# Altium schematic sheet 2_usb_debug.SchDoc: FTDI FT4232 UART Debug Circuit
size A3; Organization: Altium Limited; Address1: L3, 12a Rodborough Rd; Address2: Frenchs Forest; Address3: NSW; Address4: Australia 2086; DocumentNumber: 3; SheetNumber: 3; SheetTotal: 3
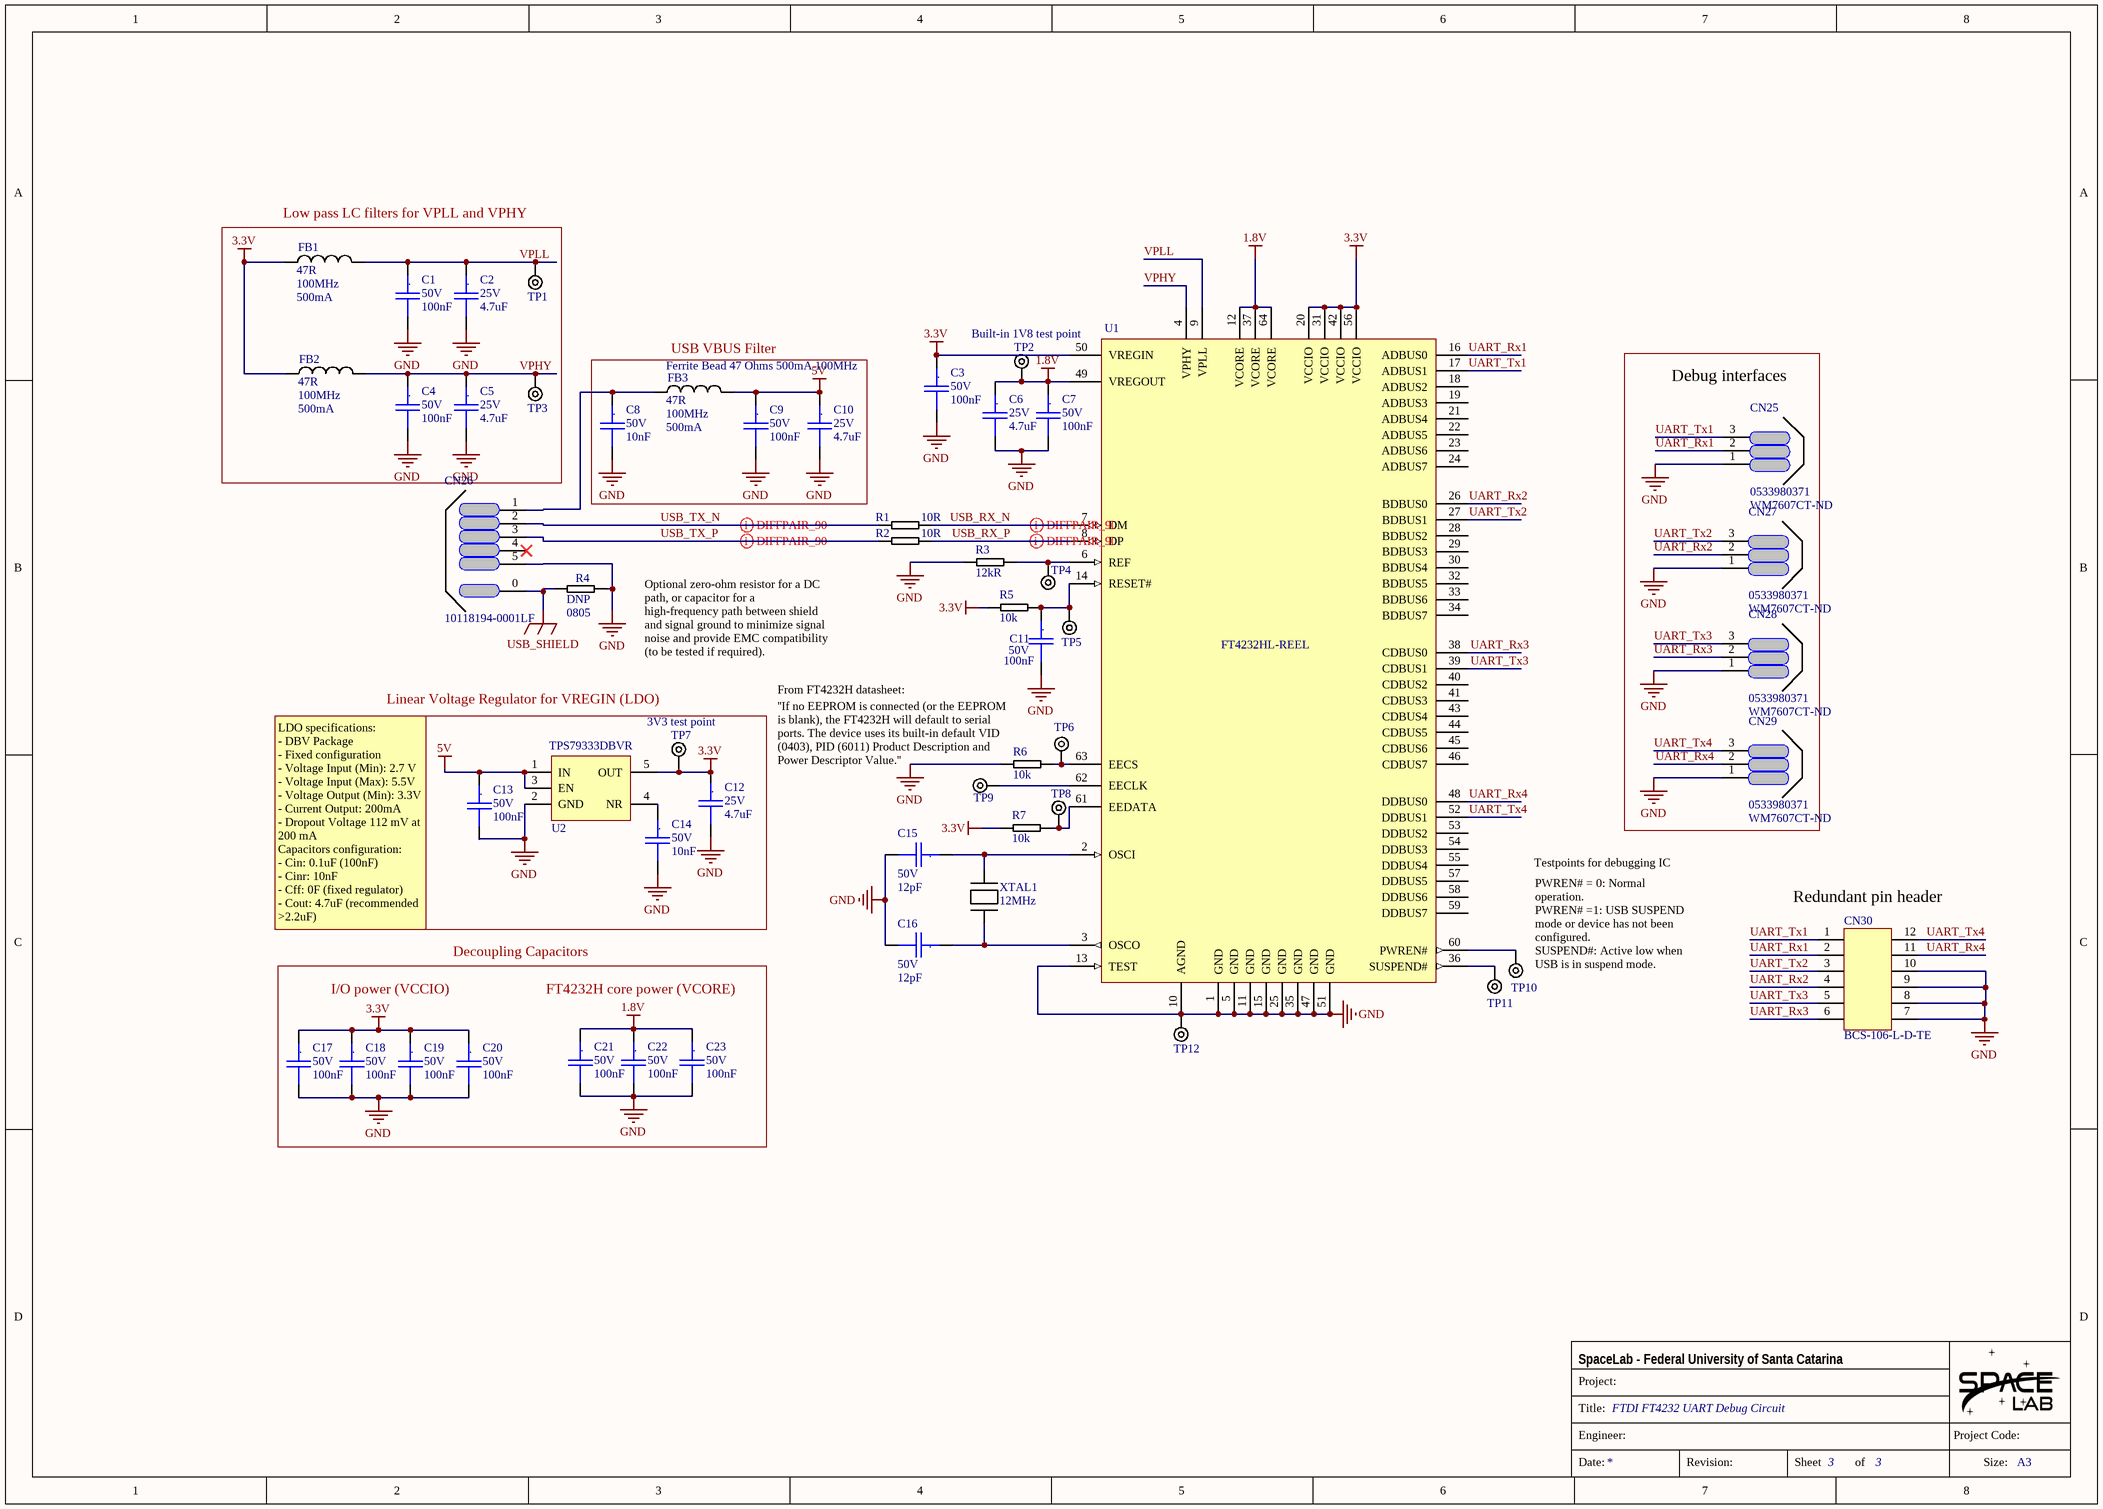
[diagram p0: 2_usb_debug.SchDoc]

## Parts
C1  Voltage Rating: 50V  Capacitance: 100nF  [C0603_MD]  (hidden comment: 0.1 uF, 0603 (1608 metric))
C2  Voltage Rating: 25V  Capacitance: 4.7uF  [C0805_MD]  (hidden comment: 4.7 uF, 0802 (2012 metric))
C3  Voltage Rating: 50V  Capacitance: 100nF  [C0603_MD]  (hidden comment: 0.1 uF, 0603 (1608 metric))
C4  Voltage Rating: 50V  Capacitance: 100nF  [C0603_MD]  (hidden comment: 0.1 uF, 0603 (1608 metric))
C5  Voltage Rating: 25V  Capacitance: 4.7uF  [C0805_MD]  (hidden comment: 4.7 uF, 0802 (2012 metric))
C6  Voltage Rating: 25V  Capacitance: 4.7uF  [C0805_MD]  (hidden comment: 4.7 uF, 0802 (2012 metric))
C7  Voltage Rating: 50V  Capacitance: 100nF  [C0603_MD]  (hidden comment: 0.1 uF, 0603 (1608 metric))
C8  Voltage: 50V  Capacitance: 10nF  [C0805_MD]  (hidden comment: 10000 pF, 0805 (2012 metric))
C9  Voltage Rating: 50V  Capacitance: 100nF  [C0603_MD]  (hidden comment: 0.1 uF, 0603 (1608 metric))
C10  Voltage Rating: 25V  Capacitance: 4.7uF  [C0805_MD]  (hidden comment: 4.7 uF, 0802 (2012 metric))
C11  Voltage Rating: 50V  Capacitance: 100nF  [C0603_MD]  (hidden comment: 0.1 uF, 0603 (1608 metric))
C12  Voltage Rating: 25V  Capacitance: 4.7uF  [C0805_MD]  (hidden comment: 4.7 uF, 0802 (2012 metric))
C13  Voltage Rating: 50V  Capacitance: 100nF  [C0603_MD]  (hidden comment: 0.1 uF, 0603 (1608 metric))
C14  Voltage: 50V  Capacitance: 10nF  [C0805_MD]  (hidden comment: 10000 pF, 0805 (2012 metric))
C15  Voltage: 50V  Capacitance: 12pF  [C0603_MD]  (hidden comment: 12 pF, 0603 (1608 metric))
C16  Voltage: 50V  Capacitance: 12pF  [C0603_MD]  (hidden comment: 12 pF, 0603 (1608 metric))
C17  Voltage Rating: 50V  Capacitance: 100nF  [C0603_MD]  (hidden comment: 0.1 uF, 0603 (1608 metric))
C18  Voltage Rating: 50V  Capacitance: 100nF  [C0603_MD]  (hidden comment: 0.1 uF, 0603 (1608 metric))
C19  Voltage Rating: 50V  Capacitance: 100nF  [C0603_MD]  (hidden comment: 0.1 uF, 0603 (1608 metric))
C20  Voltage Rating: 50V  Capacitance: 100nF  [C0603_MD]  (hidden comment: 0.1 uF, 0603 (1608 metric))
C21  Voltage Rating: 50V  Capacitance: 100nF  [C0603_MD]  (hidden comment: 0.1 uF, 0603 (1608 metric))
C22  Voltage Rating: 50V  Capacitance: 100nF  [C0603_MD]  (hidden comment: 0.1 uF, 0603 (1608 metric))
C23  Voltage Rating: 50V  Capacitance: 100nF  [C0603_MD]  (hidden comment: 0.1 uF, 0603 (1608 metric))
CN25  Supplier Part Number 1: WM7607CT-ND  [PICO BLADE 0533980371]  (hidden comment: 0533980371)
CN26  10118194-0001LF  [MICRO USB B 90GRAUS]
CN27  Supplier Part Number 1: WM7607CT-ND  [PICO BLADE 0533980371]  (hidden comment: 0533980371)
CN28  Supplier Part Number 1: WM7607CT-ND  [PICO BLADE 0533980371]  (hidden comment: 0533980371)
CN29  Supplier Part Number 1: WM7607CT-ND  [PICO BLADE 0533980371]  (hidden comment: 0533980371)
CN30  BCS-106-L-D-TE  [BCS-106-L-D-TE]
FB1  Impedance: 47R  Test Frequency: 100MHz  Current Rating: 500mA  [L0603]  (hidden comment: Ferrite Bead 47 Ohms 500mA 100MHz)
FB2  Impedance: 47R  Test Frequency: 100MHz  Current Rating: 500mA  [L0603]  (hidden comment: Ferrite Bead 47 Ohms 500mA 100MHz)
FB3  Ferrite Bead 47 Ohms 500mA 100MHz  Impedance: 47R  Test Frequency: 100MHz  Current Rating: 500mA  [L0603]
R1  Resistance: 10R  [R0603_MD]  (hidden comment: RES 10 ohms (0603))
R2  Resistance: 10R  [R0603_MD]  (hidden comment: RES 10 ohms (0603))
R3  Resistance: 12kR  [R0805_MD]  (hidden comment: RES 12K ohms (0805))
R4  DNP  Case/Package: 0805  [R0805_MD]
R5  value 10k  [R0805_MD]  (hidden comment: 10k ohms, 0805 (2012 metric))
R6  value 10k  [R0805_MD]  (hidden comment: 10k ohms, 0805 (2012 metric))
R7  value 10k  [R0805_MD]  (hidden comment: 10k ohms, 0805 (2012 metric))
TP1  DNP  [TEST POINT PTH]  (value not drawn)  (no BOM)
TP2  DNP  [TEST POINT PTH]  (value not drawn)  (no BOM)
TP3  DNP  [TEST POINT PTH]  (value not drawn)  (no BOM)
TP4  DNP  [TEST POINT PTH]  (value not drawn)  (no BOM)
TP5  DNP  [TEST POINT PTH]  (value not drawn)  (no BOM)
TP6  DNP  [TEST POINT PTH]  (value not drawn)  (no BOM)
TP7  DNP  [TEST POINT PTH]  (value not drawn)  (no BOM)
TP8  DNP  [TEST POINT PTH]  (value not drawn)  (no BOM)
TP9  DNP  [TEST POINT PTH]  (value not drawn)  (no BOM)
TP10  DNP  [TEST POINT PTH]  (value not drawn)  (no BOM)
TP11  DNP  [TEST POINT PTH]  (value not drawn)  (no BOM)
TP12  DNP  [TEST POINT PTH]  (value not drawn)  (no BOM)
U1  FT4232HL-REEL  [LQFP-64]
U2  TPS79333DBVR  [SOT23-5]
XTAL1  Frequency: 12MHz  [TXC 7A Series]  (hidden comment: 12.000MHz 12pF)

## Blocks framed on the sheet
Low pass LC filters for VPLL and VPHY: C1 C2 C4 C5 FB1 FB2 TP1 TP3
USB VBUS Filter: C8-C10 FB3
Debug interfaces: CN25 CN27-CN29
Linear Voltage Regulator for VREGIN (LDO): C12-C14 TP7 U2

## Nets
1.8V: C6.1 C7.1 C21.1 C22.1 C23.1 TP2.1 U1.12(VCORE) U1.37(VCORE) U1.49(VREGOUT) U1.64(VCORE)
3.3V: C3.1 C12.1 C17.1 C18.1 C19.1 C20.1 FB1.1 FB2.1 R5.1 R7.1 TP7.1 U1.20(VCCIO) U1.31(VCCIO) U1.42(VCCIO) U1.50(VREGIN) U1.56(VCCIO) U2.5(OUT)
5V: C9.1 C10.1 C13.1 FB3.2 U2.1(IN) U2.3(EN)
GND: C1.2 C2.2 C3.2 C4.2 C5.2 C6.2 C7.2 C8.2 C9.2 C10.2 C11.2 C12.2 C13.2 C14.2 C15.2 C16.2 C17.2 C18.2 C19.2 C20.2 C21.2 C22.2 C23.2 CN25.1 CN26.5 CN27.1 CN28.1 CN29.1 CN30.7 CN30.8 CN30.9 CN30.10 R3.1 R4.2 R6.1 TP12.1 U1.1(GND) U1.5(GND) U1.10(AGND) U1.11(GND) U1.13(TEST) U1.15(GND) U1.25(GND) U1.35(GND) U1.47(GND) U1.51(GND) U2.2(GND)
USB_SHIELD: CN26.0 R4.1
UART_Rx1: CN25.2 CN30.2 U1.16(ADBUS0)
UART_Rx2: CN27.2 CN30.4 U1.26(BDBUS0)
UART_Rx3: CN28.2 CN30.6 U1.38(CDBUS0)
UART_Rx4: CN29.2 CN30.11 U1.48(DDBUS0)
UART_Tx1: CN25.3 CN30.1 U1.17(ADBUS1)
UART_Tx2: CN27.3 CN30.3 U1.27(BDBUS1)
UART_Tx3: CN28.3 CN30.5 U1.39(CDBUS1)
UART_Tx4: CN29.3 CN30.12 U1.52(DDBUS1)
USB_RX_N: R1.2 U1.7(DM)
USB_RX_P: R2.2 U1.8(DP)
USB_TX_N: CN26.2 R1.1
USB_TX_P: CN26.3 R2.1
VPHY: C4.1 C5.1 FB2.2 TP3.1 U1.4(VPHY)
VPLL: C1.1 C2.1 FB1.2 TP1.1 U1.9(VPLL)
NetC8_1: C8.1 CN26.1 FB3.1
NetC11_1: C11.1 R5.2 TP5.1 U1.14(RESET#)
NetC14_1: C14.1 U2.4(NR)
NetC15_1: C15.1 U1.2(OSCI) XTAL1.1
NetC16_1: C16.1 U1.3(OSCO) XTAL1.2
NetR3_2: R3.2 TP4.1 U1.6(REF)
NetR6_2: R6.2 TP6.1 U1.63(EECS)
NetR7_2: R7.2 TP8.1 U1.61(EEDATA)
NetTP9_1: TP9.1 U1.62(EECLK)
NetTP10_1: TP10.1 U1.60(PWREN#)
NetTP11_1: TP11.1 U1.36(SUSPEND#)

Not connected (* = marked no-connect by the designer): CN26 4*; U1 18(ADBUS2) 19(ADBUS3) 21(ADBUS4) 22(ADBUS5) 23(ADBUS6) 24(ADBUS7) 28(BDBUS2) 29(BDBUS3) 30(BDBUS4) 32(BDBUS5) 33(BDBUS6) 34(BDBUS7) 40(CDBUS2) 41(CDBUS3) 43(CDBUS4) 44(CDBUS5) 45(CDBUS6) 46(CDBUS7) 53(DDBUS2) 54(DDBUS3) 55(DDBUS4) 57(DDBUS5) 58(DDBUS6) 59(DDBUS7)

## Layout directives
differential pair: USB_RX_N, USB_RX_P, USB_TX_N, USB_TX_P

## Notes on the sheet
- (near U1) Built-in 1V8 test point
- Optional zero-ohm resistor for a DC path, or capacitor for a high-frequency path between shield and signal ground to minimize signal noise and provide EMC compatibility (to be tested if required).
- From FT4232H datasheet:
- (near TP7) 3V3 test point
- (near R6) ''If no EEPROM is connected (or the EEPROM is blank), the FT4232H will default to serial ports. The device uses its built-in default VID (0403), PID (6011) Product Description and Power Descriptor Value.''
- (near C13) LDO specifications:
  - DBV Package
  - Fixed configuration
  - Voltage Input (Min): 2.7 V
  - Voltage Input (Max): 5.5V
  - Voltage Output (Min): 3.3V
  - Current Output: 200mA
  - Dropout Voltage 112 mV at 200 mA
  Capacitors configuration:
  - Cin: 0.1uF (100nF)
  - Cinr: 10nF
  - Cff: 0F (fixed regulator)
  - Cout: 4.7uF (recommended >2.2uF)
- Testpoints for debugging IC
- (near CN30) Redundant pin header
- Decoupling Capacitors
- (near TP10) PWREN# = 0: Normal operation.
  PWREN# =1: USB SUSPEND mode or device has not been configured.
  SUSPEND#: Active low when USB is in suspend mode.
- I/O power (VCCIO)
- FT4232H core power (VCORE)
- Project:
- SpaceLab - Federal University of Santa Catarina
- Title:
- Engineer:
- Project Code:
- Date:
- Revision:
- Sheet
- of
- Size:
- A3
- (in symbol 08055C103KAT4A) .
- (in symbol C1608X7R1H104K080AA) .
- (in symbol C2012X7R1E475K125AB) .
- (in symbol CL10C120JB8NNNC) .

## Library data of the parts
C1 C3 C4 C7 C9 C11 C13 C17-C23 = C1608X7R1H104K080AA: TDK - C1608X7R1H104K080AA - SMD Multilayer Ceramic Capacitor, 0.1 µF, 50 V, 0603 [1608 Metric], ± 10%, X7R, C Series; Supplier 1: Digi-Key; Supplier Part Number 1: 445-1314-1-ND; Manufacturer: TDK; Stock 1: 513759; Pricing 1: 1=0.12, 10=0.088, 100=0.0413, 500=0.02896, 1000=0.02397 (USD); Mount: Surface Mount; Case/Package: 0603; Number of Pins: 2; Weight: 7.1E-05oz; Case Code (Imperial): 0603; Case Code (Metric): 1608; Dielectric Material: Ceramic; Min Operating Temperature: -55°C; Max Operating Temperature: 125°C; Tolerance: 10%; Dielectric: X7R; Packaging: Tape and Reel; Package Quantity: 1; Termination: SMD/SMT; Voltage: 50V; Voltage Rating (DC): 50V; Composition: Ceramic; Length: 1.6mm; Height: 0.8mm; Depth: 0.8mm; Width: 0.8mm; Thickness: 0.037inch; Radiation Hardening: No; REACH SVHC: No SVHC; Lead Free: Lead Free; ComponentLink1URL: https://product.tdk.com/info/en/catalog/spec/mlccspec_commercial_general_midvoltage_en.pdf?src-supplier=Digi-Key; ComponentLink1Description: https://product.tdk.com/info/en/catalog/spec/mlccspec_commercial_general_midvoltage_en.pdf?src-supplier=Digi-Key; ComponentLink2URL: http://uk.rs-online.com/webdocs/13d1/0900766b813d1103.pdf?src-supplier=RSComponents; ComponentLink2Description: http://uk.rs-online.com/webdocs/13d1/0900766b813d1103.pdf?src-supplier=RSComponents; ComponentLink3URL: http://www.tdk.co.jp/tefe02/e412_c.pdf?src-supplier=Avnet+Europe; ComponentLink3Description: http://www.tdk.co.jp/tefe02/e412_c.pdf?src-supplier=Avnet+Europe; ComponentLink4URL: http://www.farnell.com/datasheets/2792994.pdf?src-supplier=Farnell; ComponentLink4Description: http://www.farnell.com/datasheets/2792994.pdf?src-supplier=Farnell; ComponentLink5URL: http://www.farnell.com/datasheets/1744655.pdf?src-supplier=Element14; ComponentLink5Description: http://www.farnell.com/datasheets/1744655.pdf?src-supplier=Element14; Supplier 2: Mouser; Supplier Part Number 2: 810-C1608X7R1H104K; Stock 2: 34512; Pricing 2: 1=0.12, 10=0.088, 100=0.041, 500=0.029, 1000=0.024, 4000=0.017, 8000=0.016, 24000=0.013, 48000=0.011 (USD); Manufacturer Part Number: C1608X7R1H104K080AA
C2 C5 C6 C10 C12 = C2012X7R1E475K125AB: Ceramic Capacitor SMD Multilayer, 0805 [2012 Metric], 4.7 uF, 25 V,  10%, X7R, C Series; Manufacturer: TDK; Supplier 1: Digi-Key; Supplier Part Number 1: 445-5972-1-ND; Stock 1: 196988; Pricing 1: 1=0.48, 10=0.339, 100=0.223, 500=0.16518, 1000=0.1404 (USD); Mount: Surface Mount; Case/Package: 0805; Weight: 0.000194oz; Case Code (Metric): 2012; Case Code (Imperial): 0805; Dielectric Material: Ceramic; Min Operating Temperature: -55°C; Max Operating Temperature: 125°C; Tolerance: 10%; Dielectric: X7R; Packaging: Tape and Reel; Voltage Rating (DC): 25V; Termination: SMD/SMT; Package Quantity: 2000; Composition: Ceramic; Voltage: 25V; Length: 2mm; Height: 1.25mm; Width: 0.049inch; Depth: 1.25mm; Thickness: 0.057inch; Radiation Hardening: No; Lead Free: Lead Free; REACH SVHC: No SVHC; ComponentLink1URL: http://www.mouser.com/ds/2/400/lcc_commercial_general_en-837201.pdf?src-supplier=Mouser; ComponentLink1Description: http://www.mouser.com/ds/2/400/lcc_commercial_general_en-837201.pdf?src-supplier=Mouser; ComponentLink2URL: https://product.tdk.com/info/en/catalog/spec/mlccspec_commercial_general_midvoltage_en.pdf?src-supplier=Digi-Key; ComponentLink2Description: https://product.tdk.com/info/en/catalog/spec/mlccspec_commercial_general_midvoltage_en.pdf?src-supplier=Digi-Key; ComponentLink3URL: http://www.farnell.com/datasheets/1796654.pdf?src-supplier=Newark; ComponentLink3Description: http://www.farnell.com/datasheets/1796654.pdf?src-supplier=Newark; ComponentLink4URL: http://www.tdk.co.jp/tefe02/e412_c.pdf?src-supplier=Avnet+Europe; ComponentLink4Description: http://www.tdk.co.jp/tefe02/e412_c.pdf?src-supplier=Avnet+Europe; Supplier 2: Mouser; Supplier Part Number 2: 810-C2012X7R1E475K; Stock 2: 141636; Pricing 2: 1=0.54, 10=0.382, 100=0.251, 500=0.186, 1000=0.158, 2000=0.121 (USD); Manufacturer Part Number: C2012X7R1E475K125AB
C8 C14 = 08055C103KAT4A: AVX - 08055C103KAT4A - SMD Multilayer Ceramic Capacitor, 10000 pF, 50 V, 0805 [2012 Metric], &#177; 10%, X7R; Manufacturer: Kyocera AVX; Supplier 1: Digi-Key; Supplier Part Number 1: 478-10687-1-ND; Stock 1: 515489; Pricing 1: 1=0.13, 10=0.094, 100=0.044, 500=0.03086, 1000=0.02555, 2500=0.02378, 5000=0.02176 (USD); Mount: Surface Mount; Case/Package: 0805; Number of Pins: 2; Weight: 0.000194oz; Case Code (Imperial): 0805; Case Code (Metric): 2012; Min Operating Temperature: -55°C; Max Operating Temperature: 125°C; Tolerance: 10%; Dielectric: X7R; Packaging: Tape and Reel; Voltage Rating: 50V; Voltage Rating (DC): 50V; Termination: SMD/SMT; Length: 2.01mm; Height: 0.94mm; Depth: 1.25mm; Width: 1.25mm; Radiation Hardening: No; Lead Free: Lead Free; ComponentLink1URL: http://www.mouser.com/ds/2/40/X7RDielectric-777024.pdf?src-supplier=Mouser; ComponentLink1Description: http://www.mouser.com/ds/2/40/X7RDielectric-777024.pdf?src-supplier=Mouser; ComponentLink2URL: http://www.avx.com/docs/Catalogs/cx7r.pdf?src-supplier=Future+Electronics; ComponentLink2Description: http://www.avx.com/docs/Catalogs/cx7r.pdf?src-supplier=Future+Electronics; Supplier 2: Mouser; Supplier Part Number 2: 581-08055C103KAT4A; Stock 2: 88428; Pricing 2: 1=0.12, 10=0.085, 100=0.04, 500=0.028, 1000=0.023, 2500=0.018 (USD); Manufacturer Part Number: 08055C103KAT4A
C15 C16 = CL10C120JB8NNNC: Cap Ceramic 12pF 50VDC C0G 5% SMD 0603 Paper T/R; Manufacturer: Samsung; Temperature Coefficient: 300ppm/°C; Supplier 1: Digi-Key; Supplier Part Number 1: 1276-1254-1-ND; Stock 1: 64675; Pricing 1: 1=0.1, 10=0.045, 100=0.0201, 500=0.01436, 1000=0.01128 (USD); Mount: Surface Mount; Case/Package: 0603; Case Code (Metric): 1608; Case Code (Imperial): 0603; Material: Ceramic; Contact Plating: Tin; Min Operating Temperature: -55°C; Max Operating Temperature: 125°C; Dielectric: C0G; Voltage Rating (DC): 50V; Voltage Rating: 50V; Package Quantity: 1; Packaging: Tape and Reel; Length: 1.6mm; Height: 0.8mm; Depth: 0.8mm; Width: 0.031inch; Thickness: 0.035inch; Radiation Hardening: No; Lead Free: Lead Free; ComponentLink1URL: https://media.digikey.com/pdf/Data%20Sheets/Samsung%20PDFs/CL_Series_MLCC_ds.pdf?src-supplier=Digi-Key; ComponentLink1Description: https://media.digikey.com/pdf/Data%20Sheets/Samsung%20PDFs/CL_Series_MLCC_ds.pdf?src-supplier=Digi-Key; ComponentLink2URL: https://www.verical.com/server-webapp/html/getDatasheet?partID=640658&src-supplier=Verical; ComponentLink2Description: https://www.verical.com/server-webapp/html/getDatasheet?partID=640658&src-supplier=Verical; ComponentLink3URL: https://produktinfo.conrad.com/datenblaetter/450000-474999/457317-da-01-en-VS_KONDENSATOR_0603.pdf?src-supplier=Conrad; ComponentLink3Description: https://produktinfo.conrad.com/datenblaetter/450000-474999/457317-da-01-en-VS_KONDENSATOR_0603.pdf?src-supplier=Conrad; Manufacturer Part Number: CL10C120JB8NNNC; Tolerance: 5%
CN25 CN27-CN29 = 0533980371: Conn Wire to Board HDR 3 POS 1.25mm Solder ST SMD Embossed T/R; Manufacturer: Molex; Manufacturer Part Number: 53398-0371; N of Positions: 3; Body Plating: Tin; Current Rating: 1A; Voltage Rating: 125V; Contact Resistance: 20mR; Insulation Resistance: 100MR; Gender: Male; Glow Wire Compliant: Non-compliant; Pitch: 1.25mm; Mount Type: SMD; Value: 0533980371; Supplier 1: Digi-Key; RoHS: Yes; Category: Headers and Wire Housings; Stock 1: 192; Pricing 1: 1=0.64000, 10=0.54400, 100=0.42320 (USD); Mount: Surface Mount; Contact Plating: Tin; Color: Natural; Contact Material: Bronze,Tin; Housing Color: Natural; Housing Material: Nylon; Min Operating Temperature: -40°C; Max Operating Temperature: 85°C; Packaging: Tape and Reel; Orientation: Vertical; Number of Rows: 1; Voltage Rating (AC): 125V; Contact Gender: Male; Package Quantity: 1000; Number of Positions: 3; Termination: SMD/SMT; Number of Contacts: 3; Working Voltage: 125V; Voltage Rating (DC): 125V; Number of Circuits: 3; Lead Pitch: 1.25mm; Radiation Hardening: No; Flammability Rating: UL94 V-0; REACH SVHC: Unknown; Lead Free: Lead Free; ComponentLink1URL: https://datasheet.ciiva.com/30064/225330533980371-pcb-headers-30064544.pdf?src-supplier=Onlinecomponents.com; ComponentLink1Description: https://datasheet.ciiva.com/30064/225330533980371-pcb-headers-30064544.pdf?src-supplier=Onlinecomponents.com; ComponentLink2URL: https://datasheet.ciiva.com/9468/0533980371-pcb-headers-9468515.pdf?src-supplier=Avnet; ComponentLink2Description: https://datasheet.ciiva.com/9468/0533980371-pcb-headers-9468515.pdf?src-supplier=Avnet; ComponentLink3URL: https://datasheet.ciiva.com/11748/0900766b8078fc93-11748675.pdf?src-supplier=RSComponents; ComponentLink3Description: https://datasheet.ciiva.com/11748/0900766b8078fc93-11748675.pdf?src-supplier=RSComponents; ComponentLink4URL: https://datasheet.ciiva.com/19465/1302182-19465258.pdf?src-supplier=Jameco; ComponentLink4Description: https://datasheet.ciiva.com/19465/1302182-19465258.pdf?src-supplier=Jameco; ComponentLink5URL: https://datasheet.ciiva.com/5147/0533980371-pcb-headers-146663-5147630.pdf?src-supplier=Mouser; ComponentLink5Description: https://datasheet.ciiva.com/5147/0533980371-pcb-headers-146663-5147630.pdf?src-supplier=Mouser; ComponentLink6URL: https://datasheet.ciiva.com/16972/70091287-16972277.pdf?src-supplier=Allied+Electronics; ComponentLink6Description: https://datasheet.ciiva.com/16972/70091287-16972277.pdf?src-supplier=Allied+Electronics; ComponentLink7URL: https://datasheet.ciiva.com/7810/1788579-7810395.pdf?src-supplier=Element14; ComponentLink7Description: https://datasheet.ciiva.com/7810/1788579-7810395.pdf?src-supplier=Element14; ComponentLink8URL: https://datasheet.ciiva.com/16496/0533980371-pcb-headers-16496972.pdf?src-supplier=Avnet+Asia; ComponentLink8Description: https://datasheet.ciiva.com/16496/0533980371-pcb-headers-16496972.pdf?src-supplier=Avnet+Asia; ComponentLink9URL: https://datasheet.ciiva.com/16658/0533980371-pcb-headers-16658430.pdf?src-supplier=Avnet+Europe; ComponentLink9Description: https://datasheet.ciiva.com/16658/0533980371-pcb-headers-16658430.pdf?src-supplier=Avnet+Europe
CN26 = 10118194-0001LF: CONN USB MICRO B RECPT SMT R/A; Manufacturer: FCI; N of Positions: 5; Pitch: 0.65mm; Gender: Receptacle; Current Rating: 1.8A; Connector Type: USB,Receptacle; Insulation Resistance: 1GR; Number of Ports: 1; Max Voltage Rating (AC): 100V; Mount Type: PTH; Supplier 1: Digi-Key; Supplier 2: Farnell; Supplier 3: Mouser; Supplier 4: Newark; Supplier Part Number 1: 609-4618-1-ND; Supplier Part Number 2: 1645325; Supplier Part Number 3: 649-10118194-0001LF; Supplier Part Number 4: 67T2260; Value: 10118194-0001LF; Manufacturer Part Number: 10118194-0001LF; RoHS: Yes; Category: USB Connectors; Stock 4: 39603; Pricing 4: 1=0.22400, 25=0.22400, 100=0.22400, 250=0.20500, 500=0.20500 (USD); Mount: Surface Mount,Horizontal; Color: Black; Contact Material: Copper Alloy; Contact Plating: Gold; Number of Terminals/Pins: 5; Housing Material: Polymer; Min Operating Temperature: -55°C; Max Operating Temperature: 85°C; Package Quantity: 9600; Packaging: Tape and Reel; Number of Contacts: 5; Termination: Solder; Orientation: Right Angle; Features: Shielded; Length: 8.05mm; Depth: 5mm; Radiation Hardening: No; Lead Free: Lead Free; Flammability Rating: UL94 V-0; ComponentLink1URL: https://datasheet.ciiva.com/4598/10118194ac-197217-4598807.pdf?src-supplier=Mouser; ComponentLink1Description: https://datasheet.ciiva.com/4598/10118194ac-197217-4598807.pdf?src-supplier=Mouser; ComponentLink2URL: https://datasheet.ciiva.com/26945/getdatasheetpartid-418619-26945695.pdf?src-supplier=Verical; ComponentLink2Description: https://datasheet.ciiva.com/26945/getdatasheetpartid-418619-26945695.pdf?src-supplier=Verical; ComponentLink3URL: https://datasheet.ciiva.com/851/10118194-851110.pdf?src-supplier=Digi-Key; ComponentLink3Description: https://datasheet.ciiva.com/851/10118194-851110.pdf?src-supplier=Digi-Key; ComponentLink4URL: https://datasheet.ciiva.com/851/10118194-851111.pdf?src-supplier=Digi-Key; ComponentLink4Description: https://datasheet.ciiva.com/851/10118194-851111.pdf?src-supplier=Digi-Key
CN30 = BCS-106-L-D-TE: CONN RCPT 12POS 0.1 GOLD PCB; Manufacturer: Samtec; Number of Contacts: 12; Gender: Receptacle; Max Current Rating: 5.9A; Contact Resistance: 10mR; Max Voltage Rating (AC): 475V; Pitch: 2.54mm; Row Spacing: 0.1inch; Supplier 1: Digi-Key; Manufacturer Part Number: BCS-106-L-D-TE; RoHS: Yes; Category: Connectors; Stock 1: 7411; Pricing 1: 1=1.77000, 10=1.60200, 25=1.50360, 50=1.43820, 100=1.37290, 250=1.24216, 500=1.14408 (USD); Mount: Through Hole; Contact Plating: Gold; Contact Material: Bronze; Color: Black; Housing Color: Black; Housing Material: Polymer; Min Operating Temperature: -55°C; Max Operating Temperature: 125°C; Number of Rows: 2; Termination: Solder; Packaging: Rail/Tube; Connector Type: Receptacle; Number of Positions: 12; Orientation: Vertical; Length: 15.24mm; Depth: 5.08mm; Width: 5.08mm; Radiation Hardening: No; REACH SVHC: No SVHC; Lead Free: Lead Free; ComponentLink1URL: https://datasheet.ciiva.com/16706/bcs-16706444.pdf?src-supplier=Avnet+Europe; ComponentLink1Description: https://datasheet.ciiva.com/16706/bcs-16706444.pdf?src-supplier=Avnet+Europe; ComponentLink2URL: https://datasheet.ciiva.com/413/bcs-1xx-xxx-x-xx-xxx-mkt-413758.pdf?src-supplier=Digi-Key; ComponentLink2Description: https://datasheet.ciiva.com/413/bcs-1xx-xxx-x-xx-xxx-mkt-413758.pdf?src-supplier=Digi-Key; Supplier Part Number 1: SAM1008-06-ND
FB1-FB3 = 742792608: WURTH ELEKTRONIK   742792608   FERRITE BEAD, 0.1 OHM, 0.5A, 0603; Manufacturer: Wurth Electronics; Resistance: 100mR; Inductance: 1H; Tolerance: 25%; Number of Lines: 1; Supplier 1: Digi-Key; Supplier Part Number 1: 732-1596-1-ND; Stock 1: 969; Pricing 1: 1=0.17, 50=0.168, 100=0.155, 500=0.148, 1000=0.141, 2000=0.134 (USD); Mount: Surface Mount; Case/Package: SMD/SMT; Weight: 0.000141oz; Core Material: Ferrite; Case Code (Metric): 1608; Case Code (Imperial): 0603; Material: Ferrite; Min Operating Temperature: -55°C; Max Operating Temperature: 125°C; Package Quantity: 1; Packaging: Tape and Reel; Max Current Rating: 500mA; DC Resistance (DCR): 100mR; Max DC Current: 500mA; Termination: SMD/SMT; Length: 1.6mm; Height: 0.8mm; Width: 0.8mm; Depth: 0.8mm; REACH SVHC: Unknown; Lead Free: Lead Free; ComponentLink1URL: http://katalog.we-online.de/pbs/datasheet/742792608.pdf?src-supplier=Digi-Key; ComponentLink1Description: http://katalog.we-online.de/pbs/datasheet/742792608.pdf?src-supplier=Digi-Key; ComponentLink2URL: http://www.farnell.com/datasheets/2290671.pdf?src-supplier=Farnell; ComponentLink2Description: http://www.farnell.com/datasheets/2290671.pdf?src-supplier=Farnell; ComponentLink3URL: http://documents.rs-components.com/techlib://itc_doclist_GB.htm?stockno=6693986&src-supplier=RSComponents; ComponentLink3Description: http://documents.rs-components.com/techlib://itc_doclist_GB.htm?stockno=6693986&src-supplier=RSComponents; ComponentLink4URL: http://www.farnell.com/datasheets/1696033.pdf?src-supplier=Element14; ComponentLink4Description: http://www.farnell.com/datasheets/1696033.pdf?src-supplier=Element14; ComponentLink5URL: http://www.mouser.com/ds/2/445/742792608-538481.pdf?src-supplier=Mouser; ComponentLink5Description: http://www.mouser.com/ds/2/445/742792608-538481.pdf?src-supplier=Mouser; ComponentLink6URL: http://www.farnell.com/datasheets/2290671.pdf?src-supplier=Newark; ComponentLink6Description: http://www.farnell.com/datasheets/2290671.pdf?src-supplier=Newark; Supplier 2: Mouser; Supplier Part Number 2: 710-742792608; Stock 2: 6414; Pricing 2: 1=0.18, 10=0.172, 25=0.172, 50=0.168, 100=0.155, 250=0.155 (USD); Manufacturer Part Number: 742792608
R1 R2 = RC0603FR-0710RL: YAGEO (PHYCOMP) - RC0603FR-0710RL - RES, THICK FILM, 10R, 1%, 0.1W, 0603; Temperature Coefficient: 200ppm/°C; Voltage Rating (DC): 50V; Power Rating: 100mW; Supplier 1: Digi-Key; Supplier Part Number 1: 311-10.0HRCT-ND; Manufacturer: Yageo; Stock 1: 9251104; Pricing 1: 1=0.1, 10=0.046, 100=0.0187, 1000=0.0084, 2500=0.00729 (USD); Case/Package: 0603; Number of Pins: 2; Case Code (Imperial): 0603; Case Code (Metric): 1608; Contact Plating: Tin,Matte; Min Operating Temperature: -55°C; Max Operating Temperature: 155°C; Tolerance: 1%; Composition: Thick Film; Packaging: Tape and Reel; Voltage Rating: 50V; Termination: SMD/SMT; Military Standard: Not; Length: 1.6mm; Height: 0.45mm; Width: 0.8mm; Depth: 0.8mm; Radiation Hardening: No; Lead Free: Lead Free; REACH SVHC: No SVHC; ComponentLink1URL: http://www.farnell.com/datasheets/1868787.pdf?src-supplier=Element14; ComponentLink1Description: http://www.farnell.com/datasheets/1868787.pdf?src-supplier=Element14; ComponentLink2URL: http://www.yageo.com/documents/recent/PYu-RC0603_51_RoHS_L_4.pdf?src-supplier=Avnet; ComponentLink2Description: http://www.yageo.com/documents/recent/PYu-RC0603_51_RoHS_L_4.pdf?src-supplier=Avnet; ComponentLink3URL: http://documents.rs-components.com/techlib://itc_doclist_GB.htm?stockno=5048984&src-supplier=RSComponents; ComponentLink3Description: http://documents.rs-components.com/techlib://itc_doclist_GB.htm?stockno=5048984&src-supplier=RSComponents; ComponentLink4URL: http://www.yageo.com/documents/recent/PYu-RC0603_51_RoHS_L_4.pdf?src-supplier=Avnet+Europe; ComponentLink4Description: http://www.yageo.com/documents/recent/PYu-RC0603_51_RoHS_L_4.pdf?src-supplier=Avnet+Europe; Supplier 2: Mouser; Supplier Part Number 2: 603-RC0603FR-0710RL; Stock 2: 267888; Pricing 2: 1=0.15, 10=0.036, 100=0.012, 1000=0.009, 5000=0.006, 10000=0.006 (USD); Manufacturer Part Number: RC0603FR-0710RL
R3 = RMCF0805FT12K0: Resistor, SMT, 0805, 12K Ohm, +/-1%, +/-100ppm, Thk Film, T/R Marked; Manufacturer: Stackpole Electronics; Power Rating: 125mW; Temperature Coefficient: 100ppm/°C; Tolerance: 1%; Supplier 1: Digi-Key; Supplier Part Number 1: RMCF0805FT12K0CT-ND; Stock 1: 30304; Pricing 1: 1=0.1, 10=0.026, 100=0.0104, 1000=0.00466, 2500=0.00405 (USD); Mount: Surface Mount; Case/Package: 0805; Case Code (Metric): 2012; Case Code (Imperial): 0805; Contact Plating: Tin,Matte; Min Operating Temperature: -55°C; Max Operating Temperature: 155°C; Packaging: Tape and Reel; Composition: Thick Film; Number of Terminations: 2; Max Power Dissipation: 125mW; Features: Automotive AEC-Q200; Length: 0.079inch; Height: 0.026inch; Width: 0.049inch; Radiation Hardening: No; Lead Free: Lead Free; ComponentLink1URL: https://www.seielect.com/catalog/SEI-RMCF_RMCP.pdf?src-supplier=Avnet; ComponentLink1Description: https://www.seielect.com/catalog/SEI-RMCF_RMCP.pdf?src-supplier=Avnet; ComponentLink2URL: https://www.seielect.com/Catalog/SEI-RMCF_RMCP.pdf?src-supplier=Digi-Key; ComponentLink2Description: https://www.seielect.com/Catalog/SEI-RMCF_RMCP.pdf?src-supplier=Digi-Key; ComponentLink3URL: https://www.seielect.com/catalog/SEI-Packaging.pdf?src-supplier=Digi-Key; ComponentLink3Description: https://www.seielect.com/catalog/SEI-Packaging.pdf?src-supplier=Digi-Key; ComponentLink4URL: http://seielect.com/Catalog/SEI-RMCF_RMCP.pdf?src-supplier=Future+Electronics; ComponentLink4Description: http://seielect.com/Catalog/SEI-RMCF_RMCP.pdf?src-supplier=Future+Electronics; ComponentLink5URL: http://components.arrow.com/part/dataview/40964023S7542466N1174?src-supplier=Arrow; ComponentLink5Description: http://components.arrow.com/part/dataview/40964023S7542466N1174?src-supplier=Arrow; Manufacturer Part Number: RMCF0805FT12K0
R4 = CRCW08050000Z0EA: VISHAY - CRCW08050000Z0EA - SMD Chip Resistor, Jumper, 0805 [2012 Metric], 0 ohm, CRCW e3 Series, 150 V, Thick Film, 125 mW; Power Rating: 125mW; Voltage Rating: 150V; Tolerance: 1%; Temperature Coefficient: 100ppm/°C; Resistance: 0mR; Supplier 1: Digi-Key; Supplier Part Number 1: 541-0.0ACT-ND; Manufacturer: Vishay; Stock 1: 487981; Pricing 1: 1=0.1, 10=0.04, 25=0.0288, 50=0.022, 100=0.0162, 250=0.01236, 500=0.0099, 1000=0.00729 (USD); Weight: 0.000194oz; Contact Plating: Tin,Lead; Case Code (Imperial): 0805; Case Code (Metric): 2012; Min Operating Temperature: -55°C; Max Operating Temperature: 155°C; Composition: Thick Film; Termination: SMD/SMT; Packaging: Tape and Reel; Package Quantity: 1; Number of Terminations: 2; Military Standard: Not; Max Power Dissipation: 125mW; Voltage Rating (DC): 150V; Features: Automotive AEC-Q200; Height: 0.45mm; Width: 1.25mm; Depth: 1.25mm; Radiation Hardening: No; Lead Free: Lead Free; REACH SVHC: Unknown; ComponentLink1URL: http://www.vishay.com/docs/20035/dcrcwe3.pdf?src-supplier=Avnet+Europe; ComponentLink1Description: http://www.vishay.com/docs/20035/dcrcwe3.pdf?src-supplier=Avnet+Europe; ComponentLink2URL: http://www.vishay.com/docs/20035/dcrcwe3.pdf?src-supplier=Distrelec; ComponentLink2Description: http://www.vishay.com/docs/20035/dcrcwe3.pdf?src-supplier=Distrelec; ComponentLink3URL: http://www.vishay.com/docs/20035/dcrcwe3.pdf?src-supplier=Mouser; ComponentLink3Description: http://www.vishay.com/docs/20035/dcrcwe3.pdf?src-supplier=Mouser; ComponentLink4URL: http://uk.rs-online.com/webdocs/0d98/0900766b80d98b26.pdf?src-supplier=RSComponents; ComponentLink4Description: http://uk.rs-online.com/webdocs/0d98/0900766b80d98b26.pdf?src-supplier=RSComponents; ComponentLink5URL: http://www.vishay.com/docs/20035/dcrcwe3.pdf?src-supplier=Future+Electronics; ComponentLink5Description: http://www.vishay.com/docs/20035/dcrcwe3.pdf?src-supplier=Future+Electronics; ComponentLink6URL: http://www.vishay.com/docs/20035/dcrcwe3.pdf?src-supplier=Allied+Electronics; ComponentLink6Description: http://www.vishay.com/docs/20035/dcrcwe3.pdf?src-supplier=Allied+Electronics; ComponentLink7URL: http://www.vishay.com/docs/20035/dcrcwe3.pdf?src-supplier=Digi-Key; ComponentLink7Description: http://www.vishay.com/docs/20035/dcrcwe3.pdf?src-supplier=Digi-Key; ComponentLink8URL: http://www.farnell.com/datasheets/2310790.pdf?src-supplier=Element14; ComponentLink8Description: http://www.farnell.com/datasheets/2310790.pdf?src-supplier=Element14; Supplier 2: Mouser; Supplier Part Number 2: 71-CRCW0805-0-E3; Stock 2: 496700; Pricing 2: 1=0.1, 10=0.024, 100=0.01, 1000=0.007, 5000=0.004, 10000=0.004 (USD); Manufacturer Part Number: CRCW08050000Z0EA; Length: 2mm
R5-R7 = CRCW080510K0FKEA: RES 10.0K OHM 1/8W 1% 0805 SMD; Manufacturer: Vishay Dale; Resistance: 10kR; Temperature Coefficient: 100ppm/°C; Power Rating: 125mW; Voltage Rating: 150V; Mount Type: SMD; Tolerance: 1%; Supplier 1: Newark; Supplier 2: Mouser; Supplier 3: Digi-Key; Supplier 4: Allied; Supplier 5: Farnell; Supplier Part Number 1: 52K9795; Supplier Part Number 2: 71-CRCW0805-10K-E3; Supplier Part Number 3: 541-10.0KCCT-ND; Supplier Part Number 4: 70201192; Supplier Part Number 5: 1632457; Supplier 6: Digi-Key; Supplier Part Number 6: 541-10.0KCDKR-ND; Stock 6: 1354479; Pricing 6: 1=0.1, 10=0.062, 100=0.0254, 1000=0.01142, 2500=0.00991 (USD); Case/Package: 0805; Weight: 0.000194oz; Contact Plating: Tin; Case Code (Imperial): 0805; Case Code (Metric): 2012; Min Operating Temperature: -55°C; Max Operating Temperature: 155°C; Composition: Thick Film; Packaging: Tape and Reel; Package Quantity: 5000; Military Standard: Not; Termination: SMD/SMT; Voltage Rating (DC): 150V; Length: 2mm; Height: 0.45mm; Width: 1.25mm; Depth: 1.25mm; Radiation Hardening: No; Lead Free: Lead Free; REACH SVHC: Unknown; ComponentLink1URL: http://www.mouser.com/ds/2/427/dcrcwe3-109170.pdf?src-supplier=Mouser; ComponentLink1Description: http://www.mouser.com/ds/2/427/dcrcwe3-109170.pdf?src-supplier=Mouser; ComponentLink2URL: http://uk.rs-online.com/webdocs/0d98/0900766b80d98b26.pdf?src-supplier=RSComponents; ComponentLink2Description: http://uk.rs-online.com/webdocs/0d98/0900766b80d98b26.pdf?src-supplier=RSComponents; ComponentLink3URL: http://www.alliedelec.com/m/d/0c934d6939ccefa68dbe0b96d821c8cf.pdf?src-supplier=Allied+Electronics; ComponentLink3Description: http://www.alliedelec.com/m/d/0c934d6939ccefa68dbe0b96d821c8cf.pdf?src-supplier=Allied+Electronics; ComponentLink4URL: http://www.vishay.com/docs/20035/dcrcwe3.pdf?src-supplier=Avnet+Asia; ComponentLink4Description: http://www.vishay.com/docs/20035/dcrcwe3.pdf?src-supplier=Avnet+Asia; ComponentLink5URL: http://www.vishay.com/docs/20035/dcrcwe3.pdf?src-supplier=Avnet+Europe; ComponentLink5Description: http://www.vishay.com/docs/20035/dcrcwe3.pdf?src-supplier=Avnet+Europe; ComponentLink6URL: http://www.farnell.com/datasheets/2310790.pdf?src-supplier=Element14; ComponentLink6Description: http://www.farnell.com/datasheets/2310790.pdf?src-supplier=Element14; ComponentLink7URL: http://www.vishay.com/docs/20035/dcrcwe3.pdf?src-supplier=Avnet; ComponentLink7Description: http://www.vishay.com/docs/20035/dcrcwe3.pdf?src-supplier=Avnet; ComponentLink8URL: http://www.vishay.com/docs/20035/dcrcwe3.pdf?src-supplier=Future+Electronics; ComponentLink8Description: http://www.vishay.com/docs/20035/dcrcwe3.pdf?src-supplier=Future+Electronics; Stock 2: 101022; Pricing 2: 1=0.1, 10=0.062, 100=0.025, 1000=0.01, 5000=0.007, 10000=0.006, 25000=0.005 (USD); Manufacturer Part Number: CRCW080510K0FKEA; Power: 1/8W
TP1-TP12 = Test Point PTH: TEST POINT PAD
U1 = FT4232HL-REEL: FTDI - FT4232HL-REEL - USB-UART/MPSSE, 4232, QUAD, 64LQFP; Number of Channels: 1; Data Rate: 480Mbps; Operating Supply Voltage: 3.3V; Max Supply Voltage: 3.63V; Min Supply Voltage: 1.62V; Operating Supply Current: 70mA; Number of Transceivers: 4; ESD Protection: Yes; Interface: UART; Supplier 1: Digi-Key; Supplier Part Number 1: 768-1026-1-ND; Manufacturer: FTDI; Stock 1: 18748; Pricing 1: 1=8.3, 10=8.09, 50=7.46, 100=7.14, 500=6.88006 (USD); Mount: Surface Mount; Case/Package: LQFP; Number of Pins: 64; Weight: 0.012088oz; Min Operating Temperature: -40°C; Max Operating Temperature: 85°C; Packaging: Tape and Reel; Package Quantity: 1000; Dual Supply Voltage: 3.3V; Length: 10.1mm; Height: 1.4mm; Width: 10.1mm; Radiation Hardening: No; Lead Free: Lead Free; ComponentLink1URL: http://www.ftdichip.com/Support/Documents/AppNotes/AN_128_User_Guide_For_FT4232H_Factory%20test%20utility.pdf?src-supplier=Digi-Key; ComponentLink1Description: http://www.ftdichip.com/Support/Documents/AppNotes/AN_128_User_Guide_For_FT4232H_Factory%20test%20utility.pdf?src-supplier=Digi-Key; ComponentLink2URL: http://www.alliedelec.com/images/products/datasheets/bm/FTDI/70403916.pdf?src-supplier=Allied+Electronics; ComponentLink2Description: http://www.alliedelec.com/images/products/datasheets/bm/FTDI/70403916.pdf?src-supplier=Allied+Electronics; ComponentLink3URL: http://www.ftdichip.com/Support/Documents/DataSheets/ICs/DS_FT4232H.pdf?src-supplier=Future+Electronics; ComponentLink3Description: http://www.ftdichip.com/Support/Documents/DataSheets/ICs/DS_FT4232H.pdf?src-supplier=Future+Electronics; ComponentLink4URL: https://www.verical.com/server-webapp/html/getDatasheet?partID=643215&src-supplier=Verical; ComponentLink4Description: https://www.verical.com/server-webapp/html/getDatasheet?partID=643215&src-supplier=Verical; ComponentLink5URL: http://datasheet.iiic.cc/ftdi/FT4232HL-REEL.pdf?src-supplier=IIIC; ComponentLink5Description: http://datasheet.iiic.cc/ftdi/FT4232HL-REEL.pdf?src-supplier=IIIC; Supplier 2: Mouser; Supplier Part Number 2: 895-FT4232HL; Stock 2: 21282; Pricing 2: 1=8.3, 25=8.09, 50=7.46, 100=7.14, 500=6.88, 1000=6.08 (USD); Manufacturer Part Number: FT4232HL-REEL
U2 = TPS79333DBVR: TEXAS INSTRUMENTS - TPS79333DBVR - IC, V REG, LINEAR, 0.2A, SOT-23-5; Number of Outputs: 1; Output Voltage: 3.3V; Max Power Dissipation: 560mW; Max Output Current: 200mA; Max Input Voltage: 5.5V; Min Input Voltage: 2.7V; Polarity: Positive; Quiescent Current: 200uA; Accuracy: 2%; Output Type: Fixed; Dropout Voltage: 102mV; Min Current Limit: 285mA; Input Bias Current: 170uA; Supplier 1: Digi-Key; Supplier Part Number 1: 296-12961-1-ND; Manufacturer: Texas Instruments; Stock 1: 21565; Pricing 1: 1=0.73, 10=0.64, 25=0.6016, 100=0.4559, 250=0.388, 500=0.3686, 1000=0.2813 (USD); Case/Package: SOT-23; Number of Pins: 5; Min Operating Temperature: -40°C; Max Operating Temperature: 125°C; Output Current: 200mA; Packaging: Tape and Reel; Package Quantity: 1; Number of Regulators: 1; Min Output Voltage: 3.3V; Power Dissipation: 560mW; Max Output Voltage: 3.3V; Output Voltage Accuracy: 2%; Nominal Output Voltage: 3.3V; Power Rating: 560mW; Max Supply Voltage: 5.5V; Min Supply Voltage: 2.7V; Termination: SMD/SMT; Current Rating: 200mA; Length: 2.9mm; Height: 1.15mm; Width: 1.6mm; Radiation Hardening: No; Lead Free: Lead Free; REACH SVHC: No SVHC; ComponentLink1URL: http://www.ti.com/general/docs/lit/getliterature.tsp?genericPartNumber=TPS793&amp;&amp;fileType=pdf&src-supplier=Farnell; ComponentLink1Description: http://www.ti.com/general/docs/lit/getliterature.tsp?genericPartNumber=TPS793&amp;&amp;fileType=pdf&src-supplier=Farnell; ComponentLink2URL: http://www.jameco.com/Jameco/Products/ProdDS/1123416.pdf?src-supplier=Jameco; ComponentLink2Description: http://www.jameco.com/Jameco/Products/ProdDS/1123416.pdf?src-supplier=Jameco; Supplier 2: Mouser; Supplier Part Number 2: 595-TPS79333DBVR; Stock 2: 31707; Pricing 2: 1=0.72, 10=0.6, 100=0.379, 1000=0.289, 2000=0.282, 3000=0.252, 9000=0.242, 48000=0.233 (USD); Manufacturer Part Number: TPS79333DBVR
XTAL1 = AA-12.000MAGE-T: Crystals 12.000MHz 30ppm 12pF -40C to 85C; Manufacturer: TXC; ESR (Equivalent Series Resistance): 100R; Frequency Stability: 50ppm; Supplier 1: Digi-Key; Supplier Part Number 1: 887-1656-1-ND; Stock 1: 2398; Pricing 1: 1=0.83, 10=0.734, 50=0.6858, 100=0.6061, 500=0.5742 (USD); Mount: Surface Mount; Case/Package: SMD/SMT; Number of Pins: 2; Min Operating Temperature: -40°C; Max Operating Temperature: 85°C; Package Quantity: 1000; Tolerance: 30ppm; Packaging: Tape and Reel; Frequency Tolerance: 30ppm; Termination: SMD/SMT; Length: 0.197inch; Height: 0.053inch; Width: 3.2mm; Ratings: AEC-Q200; REACH SVHC: No SVHC; ComponentLink1URL: http://www.txccrystal.com/images/pdf/number-crystal-automotive.pdf?src-supplier=Digi-Key; ComponentLink1Description: http://www.txccrystal.com/images/pdf/number-crystal-automotive.pdf?src-supplier=Digi-Key; ComponentLink2URL: http://www.farnell.com/datasheets/1811860.pdf?src-supplier=Element14; ComponentLink2Description: http://www.farnell.com/datasheets/1811860.pdf?src-supplier=Element14; Supplier 2: Mouser; Supplier Part Number 2: 717-AA-12.000MAGE-T; Stock 2: 4856; Pricing 2: 1=0.83, 10=0.734, 50=0.685, 100=0.606, 500=0.574, 1000=0.435 (USD); Manufacturer Part Number: AA-12.000MAGE-T